# EAGLE design Druga płytka (EAGLE 9.6.2)
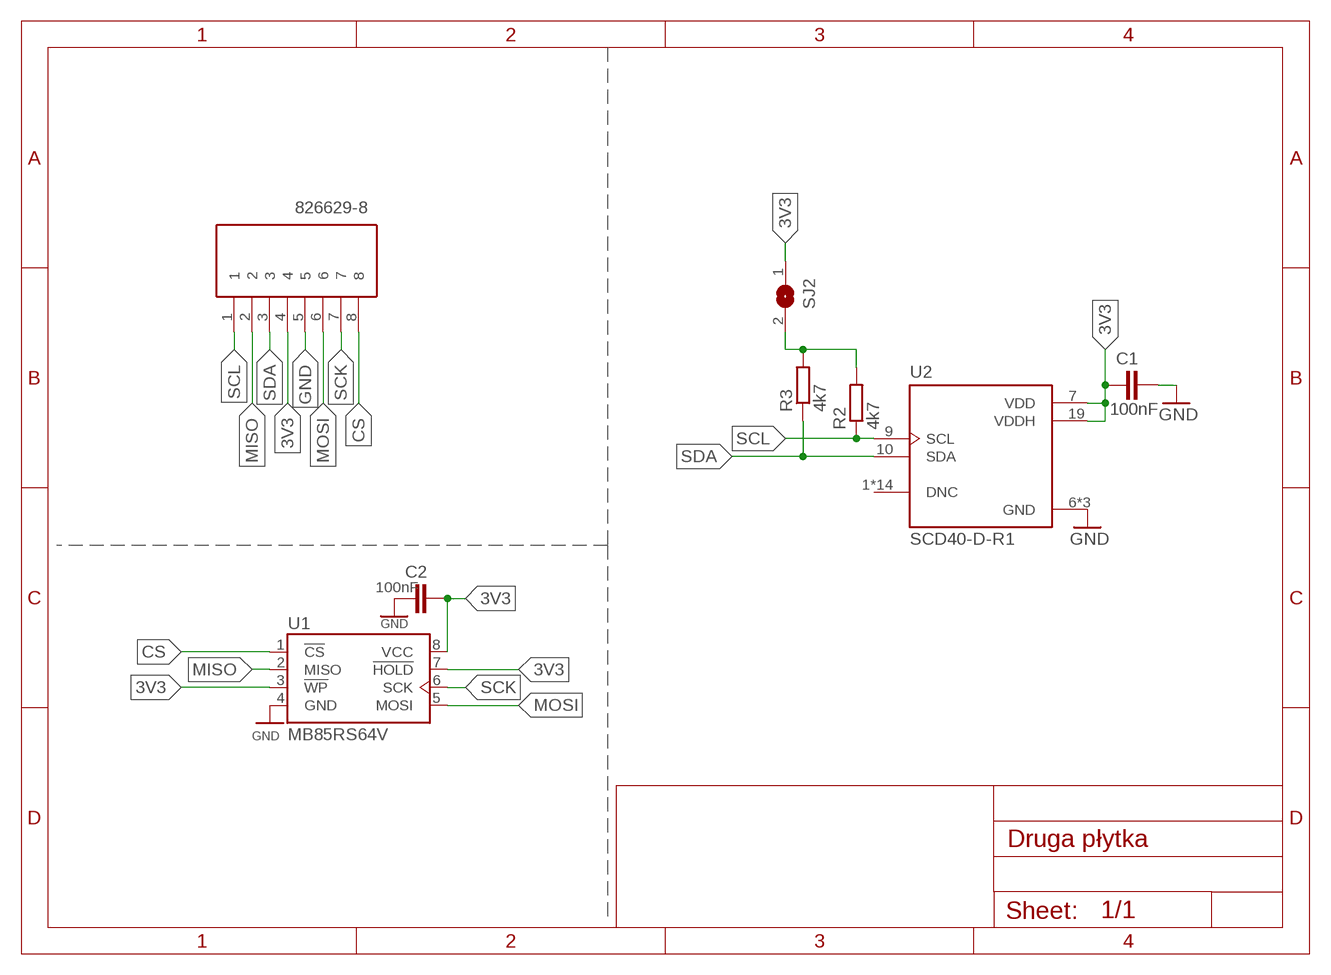
[diagram p0: schematic, sheet 1]

## Parts
C1  100nF  C-EUC0402  [C0402]
C2  100nF  C-EUC0402  [C0402]
J1  826629-8  [HDRV8W63P0X254_1X8_2032X250X95]
R2  4k7  R-EU_R1206  [R1206]
R3  4k7  R-EU_R1206  [R1206]
SJ2  SJ  [SJ]
U1  MB85RS64V  [SOIC127P600X155-8_R159_68_374R15]
U2  SCD40-D-R1  [XDCR_SCD40-D-R1]

## Nets
3V3: C1.2 C2.1 J1.4 SJ2.1 U1.3(!WP) U1.7(!HOLD) U1.8(VCC) U2.7(VDD) U2.19(VDDH)
CS: J1.8 U1.1(!CS)
GND: C1.1 C2.2 J1.5 U1.4(GND) U2.6(GND) U2.20(GND) U2.21(GND)
JUMPER: R2.2 R3.2 SJ2.2
MISO: J1.2 U1.2(MISO)
MOSI: J1.6 U1.5(MOSI)
SCK: J1.7 U1.6(SCK)
SCL: J1.1 R2.1 U2.9(SCL)
SDA: J1.3 R3.1 U2.10(SDA)
Unconnected: U2.1(DNC) U2.2(DNC) U2.3(DNC) U2.4(DNC) U2.5(DNC) U2.8(DNC) U2.11(DNC) U2.12(DNC) U2.13(DNC) U2.14(DNC) U2.15(DNC) U2.16(DNC) U2.17(DNC) U2.18(DNC)

## Library data of the parts
C1 C2 = rcl:C-EU: CAPACITOR, European symbol; SPICEPREFIX: C
J1 = 826629-8:826629-8: Body Features: Primary Product Color Green | Configuration Features: Number of Positions 8 | Board-to-Board Configuration Parallel | PCB Mount Orientation Vertical | Number of Rows 1 | Connector Contact Load Condition Fully Loaded | Contact Features: Mating Square Post Dimension .025 INCH | Contact Type Pin | Contact Underplating Material Nickel | Contact Mating Area Plating Material Gold or Gold Flash over Palladium Nickel | Mating Square Post Dimension .63 MM | Contact Shape & Form Square | Contact Mating Source: Datasheet <http://www.te.com/commerce/DocumentDelivery/DDEController?Action=showdoc&DocId=Customer Drawing826629AApdfEnglishENG_CD_826629_AA_baseFilename.pdf826629-8.pdf>; DESCRIPTION: Body Features: Primary Product Color Green | Configuration Features: Number of Positions 8 | Board-to-Board Configuration Parallel | PCB Mount Orientation Vertical | Number of Rows 1 | Connector Contact Load Condition Fully Loaded | Contact Features: Mating Square Post Dimension .025 INCH | Contact Type Pin | Contact Underplating Material Nickel | Contact Mating Area Plating Material Gold or Gold Flash over Palladium Nickel | Mating Square Post Dimension .63 MM | Contact Shape & Form Square | Contact Mating; HEIGHT: 9.5mm; MANUFACTURER_NAME: TE Connectivity; MANUFACTURER_PART_NUMBER: 826629-8; MOUSER_PART_NUMBER: 571-826629-8; MOUSER_PRICE-STOCK: https://www.mouser.co.uk/ProductDetail/TE-Connectivity/826629-8?qs=FazuUmncXokWopYWOwxkcA%3D%3D
R2 R3 = rcl:R-EU_: RESISTOR, European symbol; SPICEPREFIX: R
SJ2 = jumper:SJ: SMD solder JUMPER
U1 = MB85RS64V (1):MB85RS64V: Check availability <https://pricing.snapeda.com/parts/MB85RS64V/Fujitsu/view-part?ref=eda>; AVAILABILITY: Not in stock; CHECK_PRICES: https://www.snapeda.com/parts/MB85RS64V/Fujitsu/view-part/?ref=eda; DESCRIPTION: FRAM (Ferroelectric RAM) Memory IC 64Kb (8K x 8) SPI 20 MHz 8-SOP; MF: Fujitsu; MP: MB85RS64V; PACKAGE: None; PRICE: None; SNAPEDA_LINK: https://www.snapeda.com/parts/MB85RS64V/Fujitsu/view-part/?ref=snap
U2 = SCD40-D-R1:SCD40-D-R1: Check availability <https://pricing.snapeda.com/parts/SCD40-D-R1/Sensirion%20AG/view-part?ref=eda>; AVAILABILITY: In Stock; CHECK_PRICES: https://www.snapeda.com/parts/SCD40-D-R1/Sensirion/view-part/?ref=eda; DESCRIPTION: Carbon Dioxide (CO2), Humidity, Temperature Sensor I2C; MF: Sensirion AG; MP: SCD40-D-R1; PACKAGE: None; PRICE: None; SNAPEDA_LINK: https://www.snapeda.com/parts/SCD40-D-R1/Sensirion/view-part/?ref=snap

## Board
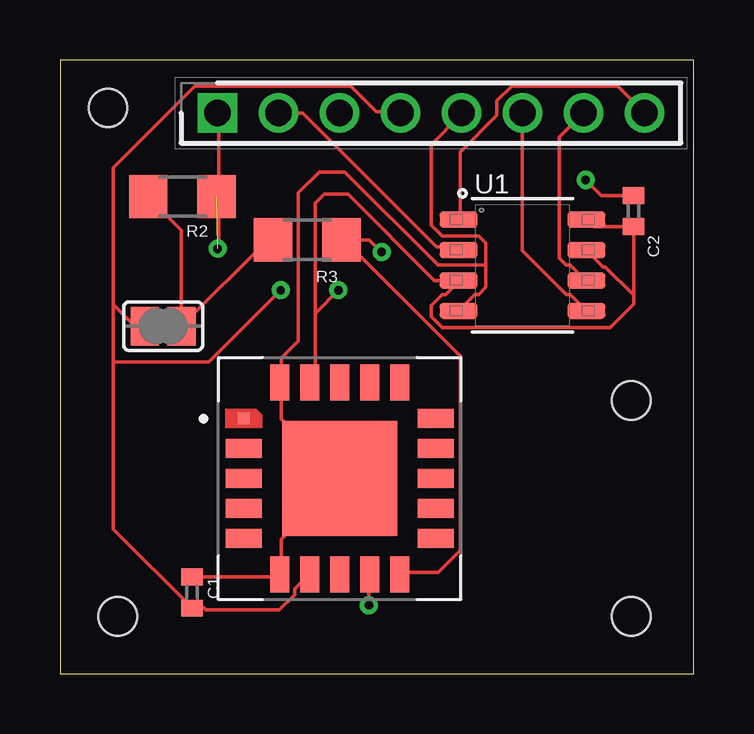
[diagram p1: board, top side]
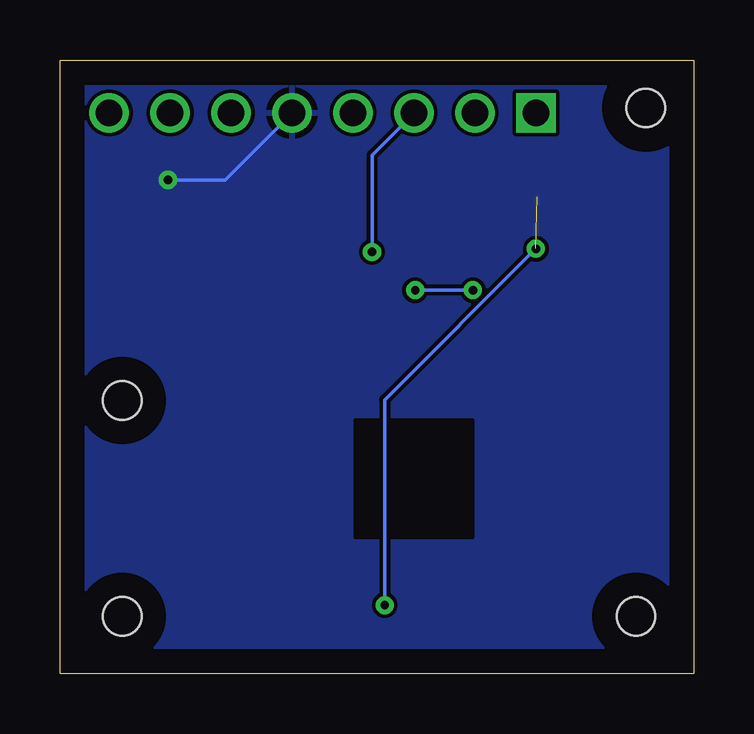
[diagram p2: board, bottom side, seen from below]

Size 26.4 x 25.6 mm. Coordinates in mm from the lower left corner, seen from the top.
Outline: 0,0 26.4,0 26.4,25.6 0,25.6 0,0
Copper layers (1*16): Top 0.035mm / dielectric 1.5mm / Bottom 0.035mm
Design rules "default": minimum track width 6mil, minimum drill 0.35mm, track to track 6mil, track to pad 6mil, pad to pad 6mil, via to via 6mil, smd to smd 6mil, copper to edge 40mil, drill to drill 6mil, minimum pad ring 10mil, minimum via ring 8mil, stop-mask expansion 4mil, vias tented up to drill 0mil, thermal gap 10mil
Holes 1.6 mm at 2.4,2.4 23.8,2.4 23.8,11.4 2,23.6

### Footprints (pad centres in the part's own frame; a part is rotated, then mirrored left to right if it is on the bottom)
C0402 = smd 0.7 x 0.9: 1 -0.65,0; 2 0.65,0
HDRV8W63P0X254_1X8_2032X250X95 = drill 1.1 pad 1.65 square: 1 0,0 | drill 1.1 pad 1.65: 2 2.54,0; 3 5.08,0; 4 7.62,0; 5 10.16,0; 6 12.7,0; 7 15.24,0; 8 17.78,0
R1206 = smd 1.6 x 1.803: 1 -1.422,0; 2 1.422,0
SJ = smd 1.168 x 1.6: 1 -0.762,0; 2 0.762,0
SOIC127P600X155-8_R159_68_374R15 = smd 1.59 x 0.68: 1 -2.665,1.905; 2 -2.665,0.635; 3 -2.665,-0.635; 4 -2.665,-1.905; 5 2.665,-1.905; 6 2.665,-0.635; 7 2.665,0.635; 8 2.665,1.905
XDCR_SCD40-D-R1 = smd 0.5 x 0.5: 1 -4,2.5 | smd 1.5 x 0.8: 2 -4,1.25; 3 -4,0; 4 -4,-1.25; 5 -4,-2.5; 11 4,-2.5; 12 4,-1.25; 13 4,0; 14 4,1.25; 15 4,2.5 | smd 0.8 x 1.5: 6 -2.5,-4; 7 -1.25,-4; 8 0,-4; 9 1.25,-4; 10 2.5,-4; 16 2.5,4; 17 1.25,4; 18 0,4; 19 -1.25,4; 20 -2.5,4 | smd 4.8 x 4.8: 21 0,0

### Placement (x,y rotation side)
C1  5.5,3.4 270 top
C2  23.9,19.3 90 top
J1  6.57,23.39 0 top
R2  5.1,19.9 180 top
R3  10.3,18.1 180 top
SJ2  4.3,14.5 0 top
U1  19.27,17.04 0 top
U2  11.65,8.15 0 top

### Tracks (layer width: path | path; a pad name or v marks a point on that pad's centre or on a via)
3V3  (via drill 0.35)
  Top 0.152: 22.01,17.8 U1.7 22.64,16.97 22.73,16.97 23.9,15.8 | 10.43,4.54 10.43,4.24 U2.7 10.38,4.14 | 10.28,12.01 U2.19 10.63,12.25 10.63,15.1 | 10.28,3.78 10.28,4.09 10.38,4.14 | J1.4 14.09,23.44 13.17,23.44 12.11,24.51 5.61,24.51 2.22,21.12 2.22,15.4 | 10.63,15.1 10.63,19.63 11,20 12,20 15.6,16.41 U1.3 16.53,16.28 16.07,15.82 15.92,15.82 15.46,15.36 15.46,14.91 15.92,14.45 22.92,14.45 23.9,15.43 23.9,15.8 | 2.22,15.4 3.12,14.5 SJ2.1 | 23.9,15.8 C2.1 22.23,18.65 U1.8 | 10.38,4.14 9.78,3.54 9.78,3.3 9.14,2.67 6.08,2.67 6,2.75 C1.2 2.22,6.03 2.22,13 | 2.22,15.4 2.22,13 | 2.22,13 6.2,13 v9.2,16 | v11.6,16 10.7,15.1 10.63,15.1
  Bottom 0.152: v9.2,16 v11.6,16
CS
  Top 0.152: J1.8 23.23,24.51 18.81,24.51 18.2,23.9 18.2,23.29 16.68,21.76 16.68,19.02 U1.1
GND  (via drill 0.35)
  Top 0.152: 17.75,17.04 17.75,17.95 17.44,18.26 15.92,18.26 15.46,18.72 15.46,22.07 16.68,23.29 J1.5 | 17.75,17.04 17.75,16.13 17.44,15.82 17.29,15.82 16.68,15.21 U1.4 | 9.21,11.71 9.21,10.64 11.65,8.2 U2.21 11.65,8.05 9.21,5.61 9.21,4.24 U2.6 9.05,4.05 C1.1 | 9.21,11.71 9.21,12.01 U2.20 | 9.21,11.71 U2.20 | 17.75,17.04 15.75,17.04 11.86,20.93 10.79,20.93 9.93,20.06 9.93,13.88 9.21,13.17 9.21,12.16 U2.20 | C2.2 22.55,19.95 v21.9,20.6
  Bottom 0.152: v21.9,20.6 19.52,20.6 J1.5
  pour Bottom: 0.1,0.1 26.3,0.1 26.3,25.5 0.1,25.5
JUMPER
  Top 0.152: 8.88,17.89 R3.2 8.66,18.1 SJ2.2 5.06,18.52 R2.2
MISO
  Top 0.152: J1.2 10.11,23.39 15.7,17.8 16.53,17.8 U1.2
MOSI
  Top 0.152: J1.6 19.27,17.65 21.1,15.82 21.25,15.82 21.86,15.21 U1.5
NONE
  cutout Bottom: 9.2,10.6 9.2,5.7 14.1,5.7 14.1,10.6
SCK
  Top 0.152: J1.7 20.79,22.37 20.79,17.35 21.1,17.04 21.25,17.04 21.86,16.43 U1.6
SCL  (via drill 0.35)  (1 unrouted)
  Top 0.152: v12.87,2.87 12.87,4.09 U2.9 | J1.1 6.62,23.29 6.62,19.8 6.62,19.63 6.62,17.78 v6.57,17.73
  Bottom 0.152: v12.87,2.87 12.87,11.43 v6.57,17.73
SDA  (via drill 0.35)
  Top 0.152: U2.10 14.24,4.24 15.77,4.24 16.68,5.15 16.68,13.26 11.84,18.1 R3.1 12.89,18.1 v13.4,17.59
  Bottom 0.152: v13.4,17.59 13.4,21.64 J1.3